# Altium schematic sheet Schematic_DE1_Project_2021-05-03.schdoc
size 417 x 236 mm
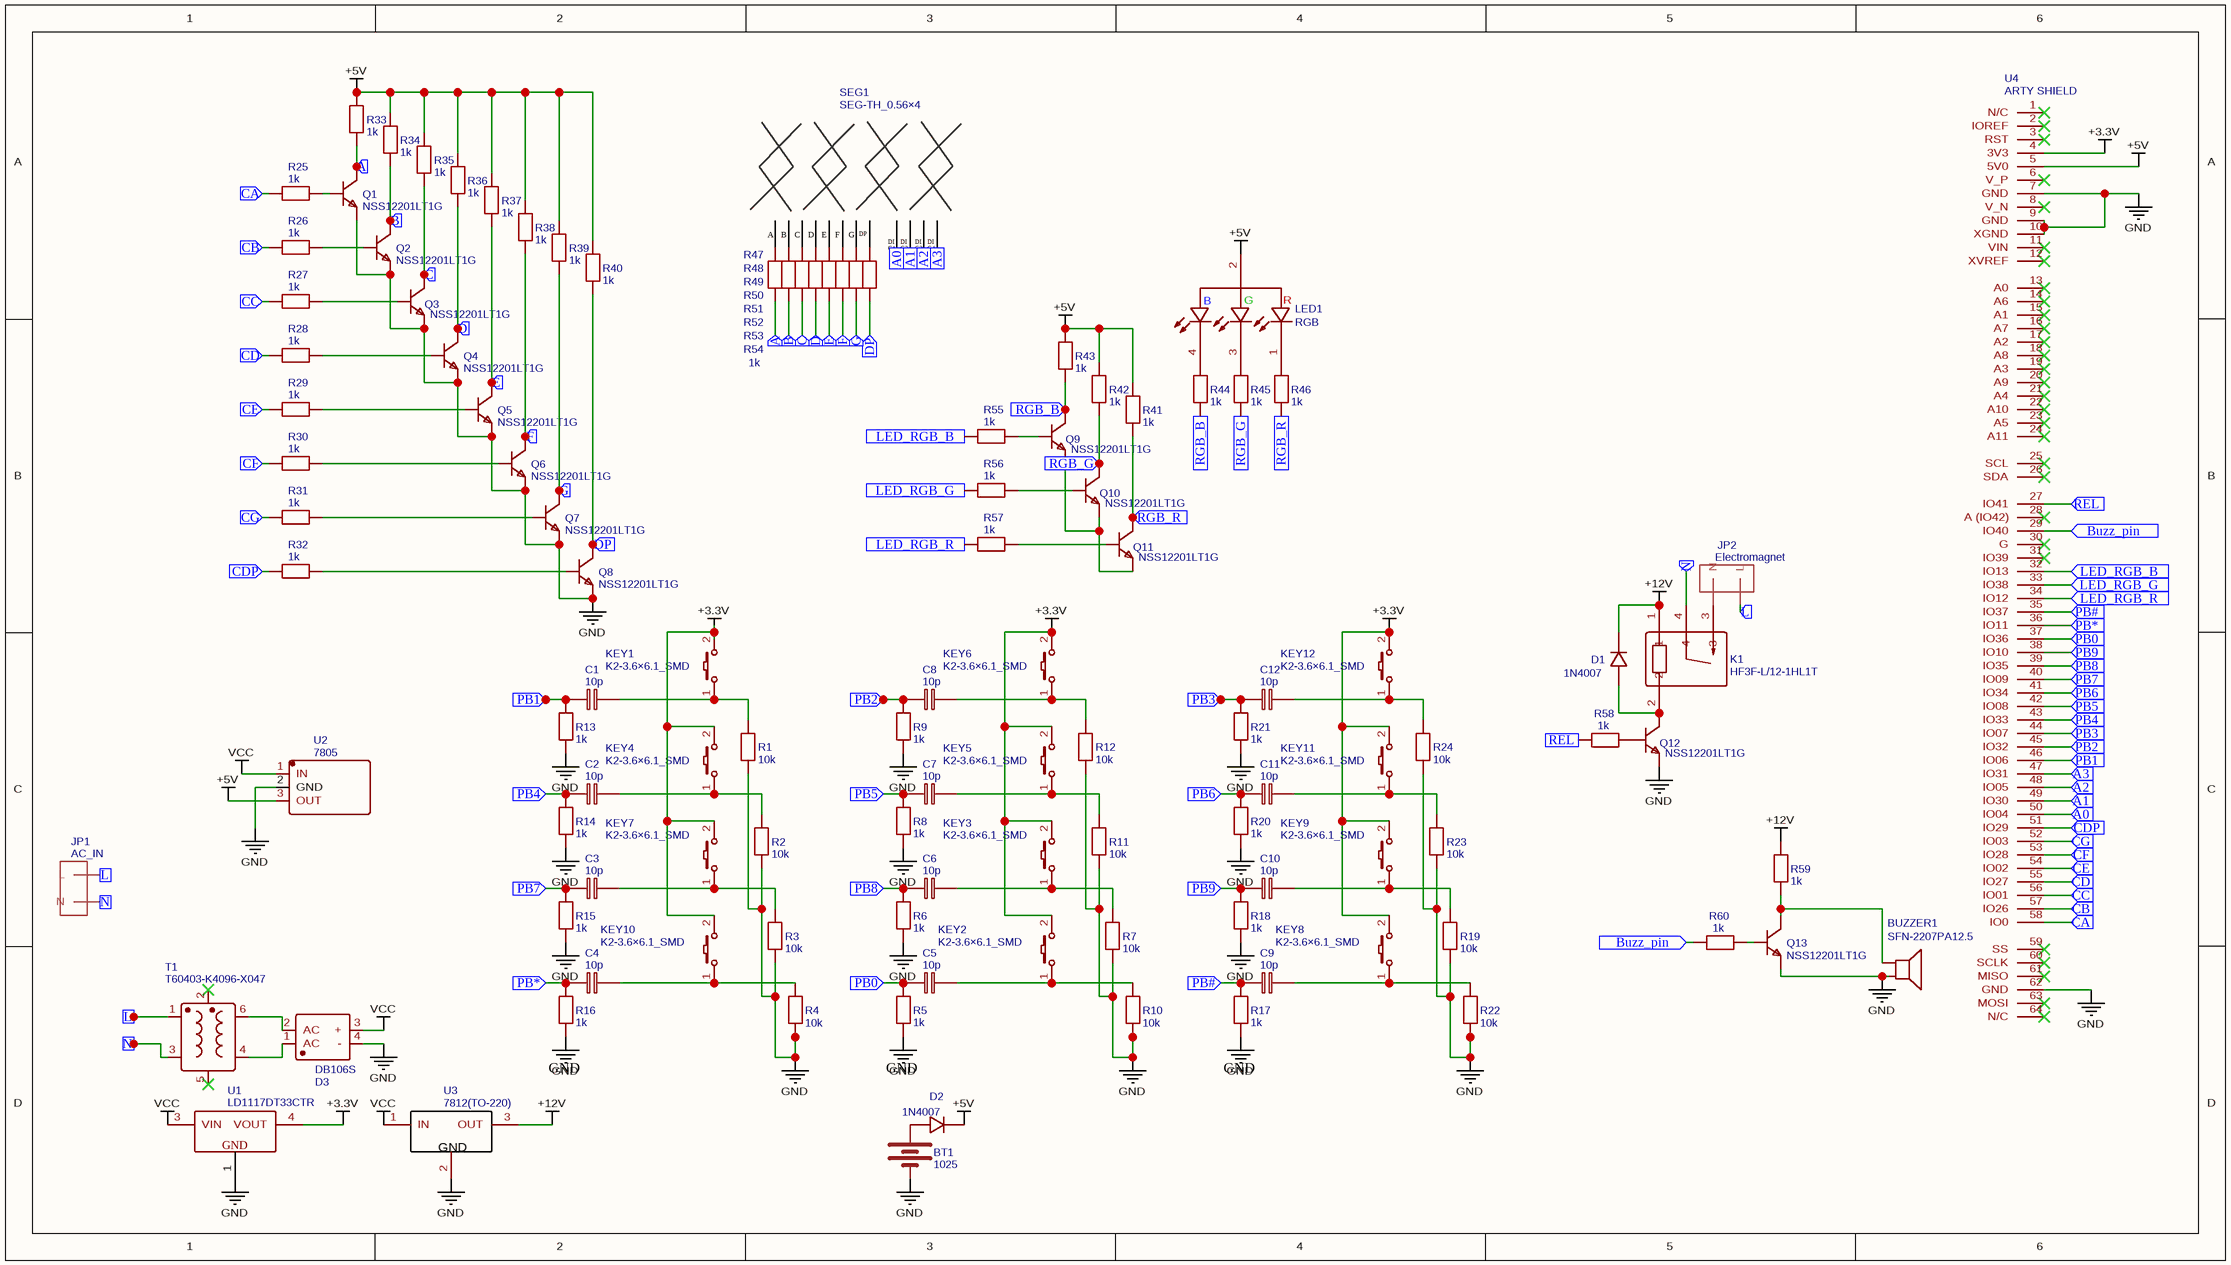
[diagram p0: Schematic_DE1_Project_2021-05-03.schdoc]

## Parts
BT1  1025  [BAT-TH_KEYSTONE-1025]
BUZZER1  SFN-2207PA12.5  [BUZ-TH_L22.0-W7.0-P12.5]
C1  10p  [C0805]
C2  10p  [C0805]
C3  10p  [C0805]
C4  10p  [C0805]
C5  10p  [C0805]
C6  10p  [C0805]
C7  10p  [C0805]
C8  10p  [C0805]
C9  10p  [C0805]
C10  10p  [C0805]
C11  10p  [C0805]
C12  10p  [C0805]
D1  1N4007  [DO-41_BD2.4-L4.7-P8.70-D0.9-RD]
D2  1N4007  [DO-41_BD2.4-L4.7-P8.70-D0.9-RD]
D3  DB106S  [DBS_L8.4-W6.4-P5.10-LS10.2-BL]
JP1  AC_IN  [1-1123724-2]
JP2  Electromagnet  [1-1123724-2]
K1  HF3F-L/12-1HL1T  [RELAY-TH_HF3F-L-XX-1HL1T]
KEY1  K2-3.6×6.1_SMD  [KEY-SMD_2P-L6.2-W3.6-LS8.0]
KEY2  K2-3.6×6.1_SMD  [KEY-SMD_2P-L6.2-W3.6-LS8.0]
KEY3  K2-3.6×6.1_SMD  [KEY-SMD_2P-L6.2-W3.6-LS8.0]
KEY4  K2-3.6×6.1_SMD  [KEY-SMD_2P-L6.2-W3.6-LS8.0]
KEY5  K2-3.6×6.1_SMD  [KEY-SMD_2P-L6.2-W3.6-LS8.0]
KEY6  K2-3.6×6.1_SMD  [KEY-SMD_2P-L6.2-W3.6-LS8.0]
KEY7  K2-3.6×6.1_SMD  [KEY-SMD_2P-L6.2-W3.6-LS8.0]
KEY8  K2-3.6×6.1_SMD  [KEY-SMD_2P-L6.2-W3.6-LS8.0]
KEY9  K2-3.6×6.1_SMD  [KEY-SMD_2P-L6.2-W3.6-LS8.0]
KEY10  K2-3.6×6.1_SMD  [KEY-SMD_2P-L6.2-W3.6-LS8.0]
KEY11  K2-3.6×6.1_SMD  [KEY-SMD_2P-L6.2-W3.6-LS8.0]
KEY12  K2-3.6×6.1_SMD  [KEY-SMD_2P-L6.2-W3.6-LS8.0]
LED1  RGB  [LED-TH_4P-BD5.8-P1.30]
Q1  NSS12201LT1G  [SOT-23-3_L2.9-W1.3-P1.90-LS2.4-BR]
Q2  NSS12201LT1G  [SOT-23-3_L2.9-W1.3-P1.90-LS2.4-BR]
Q3  NSS12201LT1G  [SOT-23-3_L2.9-W1.3-P1.90-LS2.4-BR]
Q4  NSS12201LT1G  [SOT-23-3_L2.9-W1.3-P1.90-LS2.4-BR]
Q5  NSS12201LT1G  [SOT-23-3_L2.9-W1.3-P1.90-LS2.4-BR]
Q6  NSS12201LT1G  [SOT-23-3_L2.9-W1.3-P1.90-LS2.4-BR]
Q7  NSS12201LT1G  [SOT-23-3_L2.9-W1.3-P1.90-LS2.4-BR]
Q8  NSS12201LT1G  [SOT-23-3_L2.9-W1.3-P1.90-LS2.4-BR]
Q9  NSS12201LT1G  [SOT-23-3_L2.9-W1.3-P1.90-LS2.4-BR]
Q10  NSS12201LT1G  [SOT-23-3_L2.9-W1.3-P1.90-LS2.4-BR]
Q11  NSS12201LT1G  [SOT-23-3_L2.9-W1.3-P1.90-LS2.4-BR]
Q12  NSS12201LT1G  [SOT-23-3_L2.9-W1.3-P1.90-LS2.4-BR]
Q13  NSS12201LT1G  [SOT-23-3_L2.9-W1.3-P1.90-LS2.4-BR]
R1  10k  [R0805]
R2  10k  [R0805]
R3  10k  [R0805]
R4  10k  [R0805]
R5  1k  [R0805]
R6  1k  [R0805]
R7  10k  [R0805]
R8  1k  [R0805]
R9  1k  [R0805]
R10  10k  [R0805]
R11  10k  [R0805]
R12  10k  [R0805]
R13  1k  [R0805]
R14  1k  [R0805]
R15  1k  [R0805]
R16  1k  [R0805]
R17  1k  [R0805]
R18  1k  [R0805]
R19  10k  [R0805]
R20  1k  [R0805]
R21  1k  [R0805]
R22  10k  [R0805]
R23  10k  [R0805]
R24  10k  [R0805]
R25  1k  [R0805]
R26  1k  [R0805]
R27  1k  [R0805]
R28  1k  [R0805]
R29  1k  [R0805]
R30  1k  [R0805]
R31  1k  [R0805]
R32  1k  [R0805]
R33  1k  [R0805]
R34  1k  [R0805]
R35  1k  [R0805]
R36  1k  [R0805]
R37  1k  [R0805]
R38  1k  [R0805]
R39  1k  [R0805]
R40  1k  [R0805]
R41  1k  [R0805]
R42  1k  [R0805]
R43  1k  [R0805]
R44  1k  [R0805]
R45  1k  [R0805]
R46  1k  [R0805]
R47  1k  [R0805]
R48  1k  [R0805]  (value not drawn)
R49  1k  [R0805]  (value not drawn)
R50  1k  [R0805]  (value not drawn)
R51  1k  [R0805]  (value not drawn)
R52  1k  [R0805]  (value not drawn)
R53  1k  [R0805]  (value not drawn)
R54  1k  [R0805]  (value not drawn)
R55  1k  [R0805]
R56  1k  [R0805]
R57  1k  [R0805]
R58  1k  [R0805]
R59  1k  [R0805]
R60  1k  [R0805]
SEG1  SEG-TH_0.56×4  [LED-SEG-TH_12P-L50.3-W19.0-P2.54-S15.24-BL]
T1  T60403-K4096-X047  [IND-TH_6P-L14.8-W16.6-P5.00-D0.5-S15.00]
U1  LD1117DT33CTR  [TO-252-2_L6.5-W6.1-P4.58-LS10.0-TL]
U2  7805  [TO-220-3_L10.0-W4.5-P2.54-L]
U3  7812(TO-220)  [TO-220-3_L10.0-W4.5-P2.54-L]
U4  ARTY SHIELD  [ARTYZ7-SHIELD]

## Ports
A0 (in), A1 (in), A2 (in), A3 (in), A (in), B (in), Buzz_pin (in), C (in), CA (in), CB (in), CC (in), CD (in), CDP (in), CE (in), CF (in), CG (in), D (in), DP (in), E (in), F (in), G (in), L (in), LED_RGB_B (in), LED_RGB_G (in), LED_RGB_R (in), N (in), PB0 (in), PB1 (in), PB2 (in), PB3 (in), PB4 (in), PB5 (in), PB6 (in), PB7 (in), PB8 (in), PB9 (in), PB# (in), PB* (in), REL (in), RGB_B (in), RGB_G (in), RGB_R (in)

## Nets
+3.3V: KEY1.2 KEY2.2 KEY3.2 KEY4.2 KEY5.2 KEY6.2 KEY7.2 KEY8.2 KEY9.2 KEY10.2 KEY11.2 KEY12.2 U1.4(VOUT) U4.4(3V3)
+5V: D2.1 LED1.2(CA) R33.2 R34.2 R35.2 R36.2 R37.2 R38.2 R39.2 R40.2 R41.2 R42.2 R43.2 U2.3(OUT) U4.5(5V0)
+12V: D1.1 K1.1 R59.2 U3.3(OUT)
GND: BT1.2(-) BUZZER1.2 D3.4(-) Q1.2(E) Q2.2(E) Q3.2(E) Q4.2(E) Q5.2(E) Q6.2(E) Q7.2(E) Q8.2(E) Q12.2(E) Q13.2(E) R1.1 R2.1 R3.1 R4.1 R5.1 R6.1 R7.1 R8.1 R9.1 R10.1 R11.1 R12.1 R13.1 R14.1 R15.1 R16.1 R17.1 R18.1 R19.1 R20.1 R21.1 R22.1 R23.1 R24.1 U1.1(GND) U2.2(GND) U3.2(GND) U4.7(GND) U4.9(GND) U4.10(XGND) U4.62(GND)
VCC: D3.3(+) U1.3(VIN) U2.1(IN) U3.1(IN)
A: Q1.3(C) R33.1 R47.1 ; port A
A0: SEG1.12(DIG1) U4.50(IO04) ; port A0
A1: SEG1.9(DIG2) U4.49(IO30) ; port A1
A2: SEG1.8(DIG3) U4.48(IO05) ; port A2
A3: SEG1.6(DIG4) U4.47(IO31) ; port A3
B: Q2.3(C) R34.1 R48.1 ; port B
Buzz_pin: R60.1 U4.29(IO40) ; port Buzz_pin
C: Q3.3(C) R35.1 R49.1 ; port C
CA: R25.1 U4.58(IO0) ; port CA
CB: R26.1 U4.57(IO26) ; port CB
CC: R27.1 U4.56(IO01) ; port CC
CD: R28.1 U4.55(IO27) ; port CD
CDP: R32.1 U4.51(IO29) ; port CDP
CE: R29.1 U4.54(IO02) ; port CE
CF: R30.1 U4.53(IO28) ; port CF
CG: R31.1 U4.52(IO03) ; port CG
D: Q4.3(C) R36.1 R50.1 ; port D
DP: Q8.3(C) R40.1 R54.1 ; port DP
E: Q5.3(C) R37.1 R51.1 ; port E
F: Q6.3(C) R38.1 R52.1 ; port F
G: Q7.3(C) R39.1 R53.1 ; port G
L: JP1.VCC(L) JP2.VCC(L) T1.1 ; port L
LED_RGB_B: R55.1 U4.32(IO13) ; port LED_RGB_B
LED_RGB_G: R56.1 U4.33(IO38) ; port LED_RGB_G
LED_RGB_R: R57.1 U4.34(IO12) ; port LED_RGB_R
N: JP1.12VIN(N) K1.4 T1.3 ; port N
PB0: C5.1 R5.2 U4.37(IO36) ; port PB0
PB1: C1.1 R13.2 U4.46(IO06) ; port PB1
PB2: C8.1 R9.2 U4.45(IO32) ; port PB2
PB3: C12.1 R21.2 U4.44(IO07) ; port PB3
PB4: C2.1 R14.2 U4.43(IO33) ; port PB4
PB5: C7.1 R8.2 U4.42(IO08) ; port PB5
PB6: C11.1 R20.2 U4.41(IO34) ; port PB6
PB7: C3.1 R15.2 U4.40(IO09) ; port PB7
PB8: C6.1 R6.2 U4.39(IO35) ; port PB8
PB9: C10.1 R18.2 U4.38(IO10) ; port PB9
PB#: C9.1 R17.2 U4.35(IO37) ; port PB#
PB*: C4.1 R16.2 U4.36(IO11) ; port PB*
REL: R58.1 U4.27(IO41) ; port REL
RGB_B: Q9.3(C) R43.1 R44.1 ; port RGB_B
RGB_G: Q10.3(C) R42.1 R45.1 ; port RGB_G
RGB_R: Q11.3(C) R41.1 R46.1 ; port RGB_R
NetBT1_1: BT1.1(+) D2.2
NetBUZZER1_1: BUZZER1.1 Q13.3(C) R59.1
NetC1_2: C1.2 KEY1.1 R1.2
NetC2_2: C2.2 KEY4.1 R2.2
NetC3_2: C3.2 KEY7.1 R3.2
NetC4_2: C4.2 KEY10.1 R4.2
NetC5_2: C5.2 KEY2.1 R10.2
NetC6_2: C6.2 KEY3.1 R7.2
NetC7_2: C7.2 KEY5.1 R11.2
NetC8_2: C8.2 KEY6.1 R12.2
NetC9_2: C9.2 KEY8.1 R22.2
NetC10_2: C10.2 KEY9.1 R19.2
NetC11_2: C11.2 KEY11.1 R23.2
NetC12_2: C12.2 KEY12.1 R24.2
NetD1_2: D1.2 K1.2 Q12.3(C)
NetD3_1: D3.1(AC) T1.4
NetD3_2: D3.2(AC) T1.6
NetJP2_12VIN: JP2.12VIN(N) K1.3
NetLED1_1: LED1.1(KR) R46.2
NetLED1_3: LED1.3(KG) R45.2
NetLED1_4: LED1.4(KB) R44.2
NetQ1_1: Q1.1(B) R25.2
NetQ2_1: Q2.1(B) R26.2
NetQ3_1: Q3.1(B) R27.2
NetQ4_1: Q4.1(B) R28.2
NetQ5_1: Q5.1(B) R29.2
NetQ6_1: Q6.1(B) R30.2
NetQ7_1: Q7.1(B) R31.2
NetQ8_1: Q8.1(B) R32.2
NetQ9_1: Q9.1(B) R55.2
NetQ9_2: Q9.2(E) Q10.2(E) Q11.2(E)
NetQ10_1: Q10.1(B) R56.2
NetQ11_1: Q11.1(B) R57.2
NetQ12_1: Q12.1(B) R58.2
NetQ13_1: Q13.1(B) R60.2
NetR47_2: R47.2 SEG1.11(A)
NetR48_2: R48.2 SEG1.7(B)
NetR49_2: R49.2 SEG1.4(C)
NetR50_2: R50.2 SEG1.2(D)
NetR51_2: R51.2 SEG1.1(E)
NetR52_2: R52.2 SEG1.10(F)
NetR53_2: R53.2 SEG1.5(G)
NetR54_2: R54.2 SEG1.3(DP)

Not connected (* = marked no-connect by the designer): T1 2* 5*; U4 1(N/C)* 2(IOREF)* 3(RST)* 6(V_P)* 8(V_N)* 11(VIN)* 12(XVREF)* 13(A0)* 14(A6)* 15(A1)* 16(A7)* 17(A2)* 18(A8)* 19(A3)* 20(A9)* 21(A4)* 22(A10)* 23(A5)* 24(A11)* 25(SCL)* 26(SDA)* 28(A_(IO42))* 30(G)* 31(IO39)* 59(SS)* 60(SCLK)* 61(MISO)* 63(MOSI)* 64(N/C)*

## Notes on the sheet
- (near R16) GND
- GND
- (near R17) GND
- (in symbol RGB) B; G; R
- (in symbol SEG-TH_0.56×4) DI / G1; DI / G2; DI / G3; DI / G4

## Library data of the parts
BT1 = 1025: BOM_Manufacturer: Keystone; Contributor: LCSC; SMT Type: Extend; BOM_Paste Type: expand; BOM_Supplier: LCSC; BOM_Supplier Part: C238060; BOM_Manufacturer Part: 1025; BOM_LCSC Assembly: Yes; spicePre: B; spiceSymbolName: 1025
BUZZER1 = SFN-2207PA12.5: BOM_Manufacturer: S&S; Contributor: LCSC; SMT Type: Extend; BOM_Paste Type: expand; BOM_Supplier: LCSC; BOM_Supplier Part: C360602; BOM_Manufacturer Part: SFN-2207PA12.5; BOM_LCSC Assembly: Yes; spicePre: B; spiceSymbolName: SFN-2207PA12.5
C1-C12 = 10p: nameAlias: Value(F); Contributor: LCEDA_Lib; spicePre: C; spiceSymbolName: C_0805_EU
D1 D2 = 1N4007: BOM_Manufacturer: SEMTECH; Contributor: LCEDA_Lib; BOM_Supplier: LCSC; BOM_Manufacturer Part: 1N4007; BOM_Supplier Part: C106903; spicePre: D; spiceSymbolName: 1N4007
D3 = DB106S: BOM_Manufacturer: MOSPEC; Contributor: LCSC; BOM_Supplier: LCSC; BOM_Manufacturer Part: DB106S; BOM_Supplier Part: C139036; spicePre: D; spiceSymbolName: DB106S
JP1 = AC_IN: Contributor: tianfeng; spicePre: J; spiceSymbolName: DC-POWERSWITCH-1-1123724-2
JP2 = Electromagnet: Contributor: tianfeng; spicePre: J; spiceSymbolName: DC-POWERSWITCH-1-1123724-2
K1 = HF3F-L/12-1HL1T: BOM_Manufacturer: Xiamen Hongfa Electroacoustic; Contributor: LCSC; SMT Type: Extend; BOM_Paste Type: expand; BOM_Supplier: LCSC; BOM_Supplier Part: C190456; BOM_Manufacturer Part: HF3F-L/12-1HL1T; BOM_LCSC Assembly: Yes; spicePre: K; spiceSymbolName: HF3F-L/12-1HL1T
KEY1-KEY12 = K2-3.6×6.1_SMD: BOM_Manufacturer Part: K2-1107ST-A4SW-06; Contributor: LCEDA_Lib; 制造商: 韩国韩荣; BOM_Supplier Part: C118141; BOM_Supplier: LCSC; spicePre: K; spiceSymbolName: K2-3.6×6.1_SMD
LED1 = RGB: BOM_Manufacturer: KENTO; BOM_Manufacturer Part: φ5 RGB Transparent LED; Contributor: LCSC; BOM_Supplier: LCSC; BOM_Supplier Part: C32985; spicePre: L; spiceSymbolName: φ5 RGB Transparent
Q1-Q13 = NSS12201LT1G: BOM_Manufacturer: ON Semicon; Contributor: LCSC; SMT Type: Extend; BOM_Paste Type: expand; BOM_Supplier: LCSC; BOM_Supplier Part: C242296; BOM_Manufacturer Part: NSS12201LT1G; BOM_JLCPCB SMD: Yes; BOM_LCSC Assembly: Yes; spicePre: Q; spiceSymbolName: NSS12201LT1G
R1-R4 R7 R10-R12 R19 R22-R24 = 10k: nameAlias: Value(Ω); Contributor: LCEDA_Lib; spicePre: R; spiceSymbolName: R_0805_EU
R5 R6 R8 R9 R13-R18 R20 R21 R25-R60 = 1k: nameAlias: Value(Ω); Contributor: LCEDA_Lib; spicePre: R; spiceSymbolName: R_0805_EU
SEG1 = SEG-TH_0.56×4: BOM_Manufacturer: 方舟 ARKLED; Contributor: LCEDA_01; BOM_Supplier Part: C109200; spicePre: S; spiceSymbolName: SEG-TH_0.56×4
T1 = T60403-K4096-X047: BOM_Manufacturer: VAC; Contributor: LCSC; BOM_Supplier: LCSC; BOM_Supplier Part: C465442; BOM_Manufacturer Part: T60403-K4096-X047; spicePre: T; spiceSymbolName: T60403-K4096-X047
U1 = LD1117DT33CTR: BOM_Manufacturer: STMicroelectronics; SMT Type: Extend; BOM_Paste Type: expand; BOM_Supplier: LCSC; BOM_Manufacturer Part: LD1117DT33CTR; image: //image.lceda.cn/szlcsc/C36395.jpg; BOM_Supplier Part: C36395; BOM_JLCPCB SMD: Yes; BOM_LCSC Assembly: Yes; spicePre: U; spiceSymbolName: LD1117DT33CTR
U2 = 7805: BOM_Manufacturer: Foshan Blue Rocket Elec; Contributor: LCSC; SMT Type: Extend; BOM_Paste Type: expand; BOM_Supplier: LCSC; BOM_Supplier Part: C305416; BOM_Manufacturer Part: 7805; BOM_LCSC Assembly: Yes; spicePre: U; spiceSymbolName: 7805
U3 = 7812(TO-220): BOM_Manufacturer: ON; BOM_Manufacturer Part: MC7812BTG; Contributor: LCEDA_Lib; BOM_Supplier: LCSC; image: //image.lceda.cn/szlcsc/C45387.jpg; BOM_Supplier Part: C45387; spicePre: U; spiceSymbolName: 7812(TO-220)
U4 = ARTY SHIELD: BOM_Manufacturer: MPT; BOM_Manufacturer Part: MPT-DTI-UAV-00000; Contributor: Scott Ramirez; spicePre: U; spiceSymbolName: ARTY SHIELD